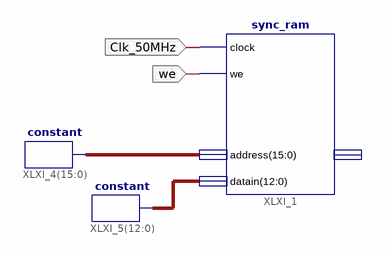
[diagram p0: schematic sheet 1]
// Xilinx ISE schematic testmain.sch (spartan3e) as structural Verilog: 3 symbols, 2 ports
module testmain (
  input  Clk_50MHz,
  input  we
);

  wire [12:0] XLXN_5;
  wire [15:0] XLXN_3;

  sync_ram XLXI_1 (.clock(Clk_50MHz), .we(we), .address(XLXN_3), .datain(XLXN_5));  // open: dataout
  constant XLXI_4[15:0] (.O(XLXN_3));
  constant XLXI_5[12:0] (.O(XLXN_5));
endmodule
